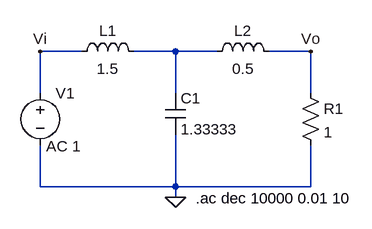
[diagram p0: schematic Ejercicio_MAI.asc]
Ejercicio_MAI.asc, the LTspice schematic file:
Version 4
SHEET 1 880 680
WIRE 80 96 16 96
WIRE 224 96 160 96
WIRE 288 96 224 96
WIRE 432 96 368 96
WIRE 16 160 16 96
WIRE 224 160 224 96
WIRE 432 160 432 96
WIRE 16 304 16 240
WIRE 224 304 224 224
WIRE 224 304 16 304
WIRE 432 304 432 240
WIRE 432 304 224 304
WIRE 224 320 224 304
FLAG 224 320 0
FLAG 432 96 Vo
FLAG 16 96 Vi
SYMBOL voltage 16 144 R0
WINDOW 123 9 98 Left 2
WINDOW 39 0 0 Left 0
SYMATTR InstName V1
SYMATTR Value ""
SYMATTR Value2 AC 1
SYMBOL ind 64 112 R270
WINDOW 0 32 56 VTop 2
WINDOW 3 5 56 VBottom 2
SYMATTR InstName L1
SYMATTR Value 1.5
SYMBOL ind 272 112 R270
WINDOW 0 32 56 VTop 2
WINDOW 3 5 56 VBottom 2
SYMATTR InstName L2
SYMATTR Value 0.5
SYMBOL cap 208 160 R0
SYMATTR InstName C1
SYMATTR Value 1.33333
SYMBOL res 416 144 R0
SYMATTR InstName R1
SYMATTR Value 1
TEXT 255 322 Left 2 !.ac dec 10000 0.01 10

The netlist it stands for:
* Ejercicio_MAI.asc
V1 Vi 0 AC 1
L1 Vi N001 1.5
L2 N001 Vo 0.5
C1 N001 0 1.33333
R1 Vo 0 1
.ac dec 10000 0.01 10
.backanno
.end